# Altium schematic sheet MI_04_05_Rev_2_0.SchDoc
size A4
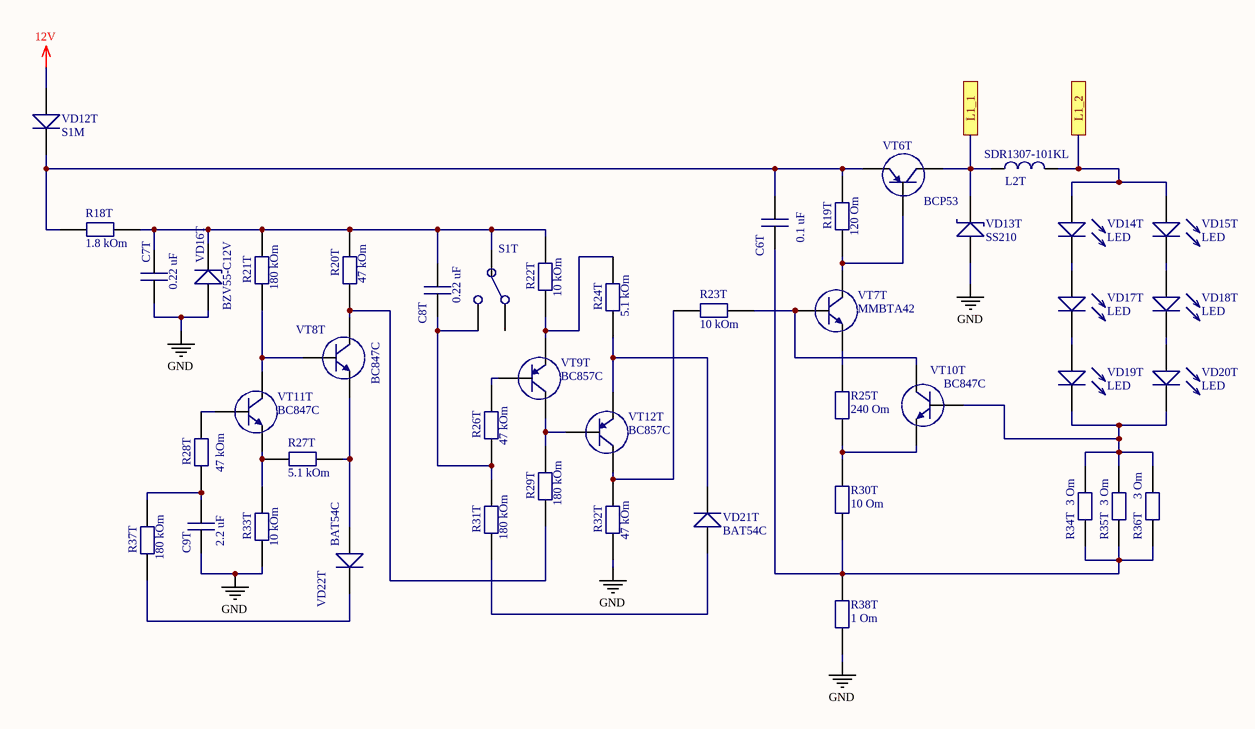
[diagram p0: MI_04_05_Rev_2_0.SchDoc]

## Parts
C6T  value 0.1 uF  [CAP1206]  (hidden comment: Capacitor)
C7T  value 0.22 uF  [CAP1206]  (hidden comment: Capacitor)
C8T  value 0.22 uF  [CAP1206]  (hidden comment: Capacitor)
C9T  value 2.2 uF  [CAP1206]  (hidden comment: Capacitor)
L2T  value SDR1307-101KL  [SDR1307]  (hidden comment: coil)
R18T  value 1.8 kOm  [RES1206]  (hidden comment: Resistor)
R19T  value 120 Om  [RES1206]  (hidden comment: Resistor)
R20T  value 47 kOm  [RES1206]  (hidden comment: Resistor)
R21T  value 180 kOm  [RES1206]  (hidden comment: Resistor)
R22T  value 10 kOm  [RES1206]  (hidden comment: Resistor)
R23T  value 10 kOm  [RES1206]  (hidden comment: Resistor)
R24T  value 5.1 kOm  [RES1206]  (hidden comment: Resistor)
R25T  value 240 Om  [RES1206]  (hidden comment: Resistor)
R26T  value 47 kOm  [RES1206]  (hidden comment: Resistor)
R27T  value 5.1 kOm  [RES1206]  (hidden comment: Resistor)
R28T  value 47 kOm  [RES1206]  (hidden comment: Resistor)
R29T  value 180 kOm  [RES1206]  (hidden comment: Resistor)
R30T  value 10 Om  [RES1206]  (hidden comment: Resistor)
R31T  value 180 kOm  [RES1206]  (hidden comment: Resistor)
R32T  value 47 kOm  [RES1206]  (hidden comment: Resistor)
R33T  value 10 kOm  [RES1206]  (hidden comment: Resistor)
R34T  value 3 Om  [RES1206]  (hidden comment: Resistor)
R35T  value 3 Om  [RES1206]  (hidden comment: Resistor)
R36T  value 3 Om  [RES1206]  (hidden comment: Resistor)
R37T  value 180 kOm  [RES1206]  (hidden comment: Resistor)
R38T  value 1 Om  [RES1206]  (hidden comment: Resistor)
S1T  (no value)  [Solder_connector]
VD12T  value S1M  [SMA-F]  (hidden comment: Diode)
VD13T  value SS210  [SMB1]  (hidden comment: Schottky)
VD14T  LED  [LED_MAJAK]
VD15T  LED  [LED_MAJAK]
VD16T  value BZV55-C12V  [minimelf]  (hidden comment: Zenner)
VD17T  LED  [LED_MAJAK]
VD18T  LED  [LED_MAJAK]
VD19T  LED  [LED_MAJAK]
VD20T  LED  [LED_MAJAK]
VD21T  value BAT54C  [SOT 23]  (hidden comment: Diode)
VD22T  value BAT54C  [SOT 23]  (hidden comment: Diode)
VT6T  value BCP53  [SOT223]  (hidden comment: PNP)
VT7T  value MMBTA42  [SOT 23]  (hidden comment: NPN)
VT8T  value BC847C  [SOT 23]  (hidden comment: NPN)
VT9T  value BC857C  [SOT 23]  (hidden comment: PNP)
VT10T  value BC847C  [SOT 23]  (hidden comment: NPN)
VT11T  value BC847C  [SOT 23]  (hidden comment: NPN)
VT12T  value BC857C  [SOT 23]  (hidden comment: PNP)

## Ports
L1_1, L1_2

## Nets
12V: VD12T.2
GND: C7T.1 C9T.1 R32T.2 R33T.2 R38T.1 VD13T.2 VD16T.2
L1_1: L2T.1 VD13T.1 VT6T.K ; port L1_1
L1_2: L2T.2 VD14T.2 VD15T.2 ; port L1_2
NetC6T_1: C6T.1 R30T.1 R34T.1 R35T.1 R36T.1 R38T.2
NetC6T_2: C6T.2 R18T.2 R19T.1 VD12T.1 VT6T.E
NetC7T_2: C7T.2 C8T.2 R18T.1 R20T.1 R21T.1 R22T.1 S1T.1 VD16T.1
NetC8T_1: C8T.1 R26T.2 R31T.1 S1T.2
NetC9T_2: C9T.2 R28T.2 R37T.1
NetR19T_2: R19T.2 VT6T.B VT7T.K
NetR20T_2: R20T.2 R29T.2 VT8T.K
NetR21T_2: R21T.2 VT8T.B VT11T.K
NetR22T_2: R22T.2 R24T.1 VT9T.E
NetR23T_1: R23T.1 R32T.1 VT12T.K
NetR23T_2: R23T.2 VT7T.B VT10T.K
NetR24T_2: R24T.2 VD21T.1 VT12T.E
NetR25T_1: R25T.1 R30T.2 VT10T.E
NetR25T_2: R25T.2 VT7T.E
NetR26T_1: R26T.1 VT9T.B
NetR27T_1: R27T.1 VD22T.2 VT8T.E
NetR27T_2: R27T.2 R33T.1 VT11T.E
NetR28T_1: R28T.1 VT11T.B
NetR29T_1: R29T.1 VT9T.K VT12T.B
NetR31T_2: R31T.2 VD21T.2
NetR34T_2: R34T.2 R35T.2 R36T.2 VD19T.1 VD20T.1 VT10T.B
NetR37T_2: R37T.2 VD22T.1
NetVD14T_1: VD14T.1 VD17T.2
NetVD15T_1: VD15T.1 VD18T.2
NetVD17T_1: VD17T.1 VD19T.2
NetVD18T_1: VD18T.1 VD20T.2

Not connected (* = marked no-connect by the designer): S1T 3

## Library data of the parts
S1T = switch: pin to pad: 3>2; Value: switch
VD21T VD22T = Diode: pin to pad: 1>3 2>1+2
VT6T = PNP: pin to pad: B>1 E>3 K>2
VT7T VT8T VT10T VT11T = NPN: pin to pad: B>1 E>2 K>3
VT9T VT12T = PNP: pin to pad: B>1 E>2 K>3
VD14T VD15T VD17T VD18T VD19T VD20T = LED: Value: LED